# EAGLE design dual power supply1 (EAGLE 9.6.2)
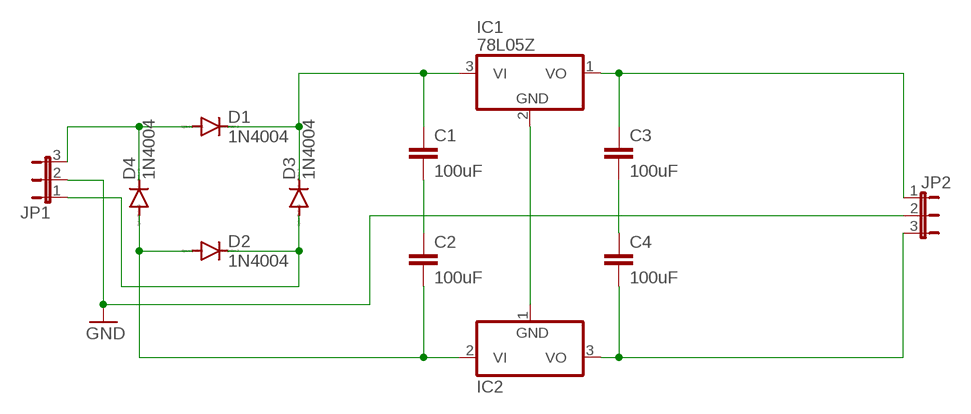
[diagram p0: schematic, sheet 1]

## Parts
C1  100uF  C2.5/2  [C2.5-2]
C2  100uF  C2.5/2  [C2.5-2]
C3  100uF  C2.5/2  [C2.5-2]
C4  100uF  C2.5/2  [C2.5-2]
D1  1N4004  [DO41-10]
D2  1N4004  [DO41-10]
D3  1N4004  [DO41-10]
D4  1N4004  [DO41-10]
IC1  78L05Z  [TO92]
IC2  7905L  [TO92]
JP1  JP2E  [JP2]
JP2  JP2E  [JP2]

## Nets
GND: JP1.2 JP2.2
N$1: D1.A D4.C JP1.3
N$2: C1.1 D1.C D3.C IC1.3(VI)
N$3: D2.C D3.A JP1.1
N$4: C2.2 D2.A D4.A IC2.2(VI)
N$6: IC1.2(GND) IC2.1(GND)
N$7: C3.1 IC1.1(VO) JP2.1
N$8: C4.2 IC2.3(VO) JP2.3
N$9: C1.2 C2.1
N$10: C3.2 C4.1

## Library data of the parts
C1-C4 = capacitor-wima:C: CAPACITOR naming: grid - package width
D1-D4 = diode:1N4004: DIODE general purpose rectifier, 1 A
IC1 = linear:78*: Positive VOLTAGE REGULATOR Source: http://cache.national.com/ds/LM/LM78L05.pdf http://www.fairchildsemi.com/ds/LM/LM7805.pdf
IC2 = linear:79*: Negative VOLTAGE REGULATOR
JP1 JP2 = jumper:JP2E: JUMPER

## Board
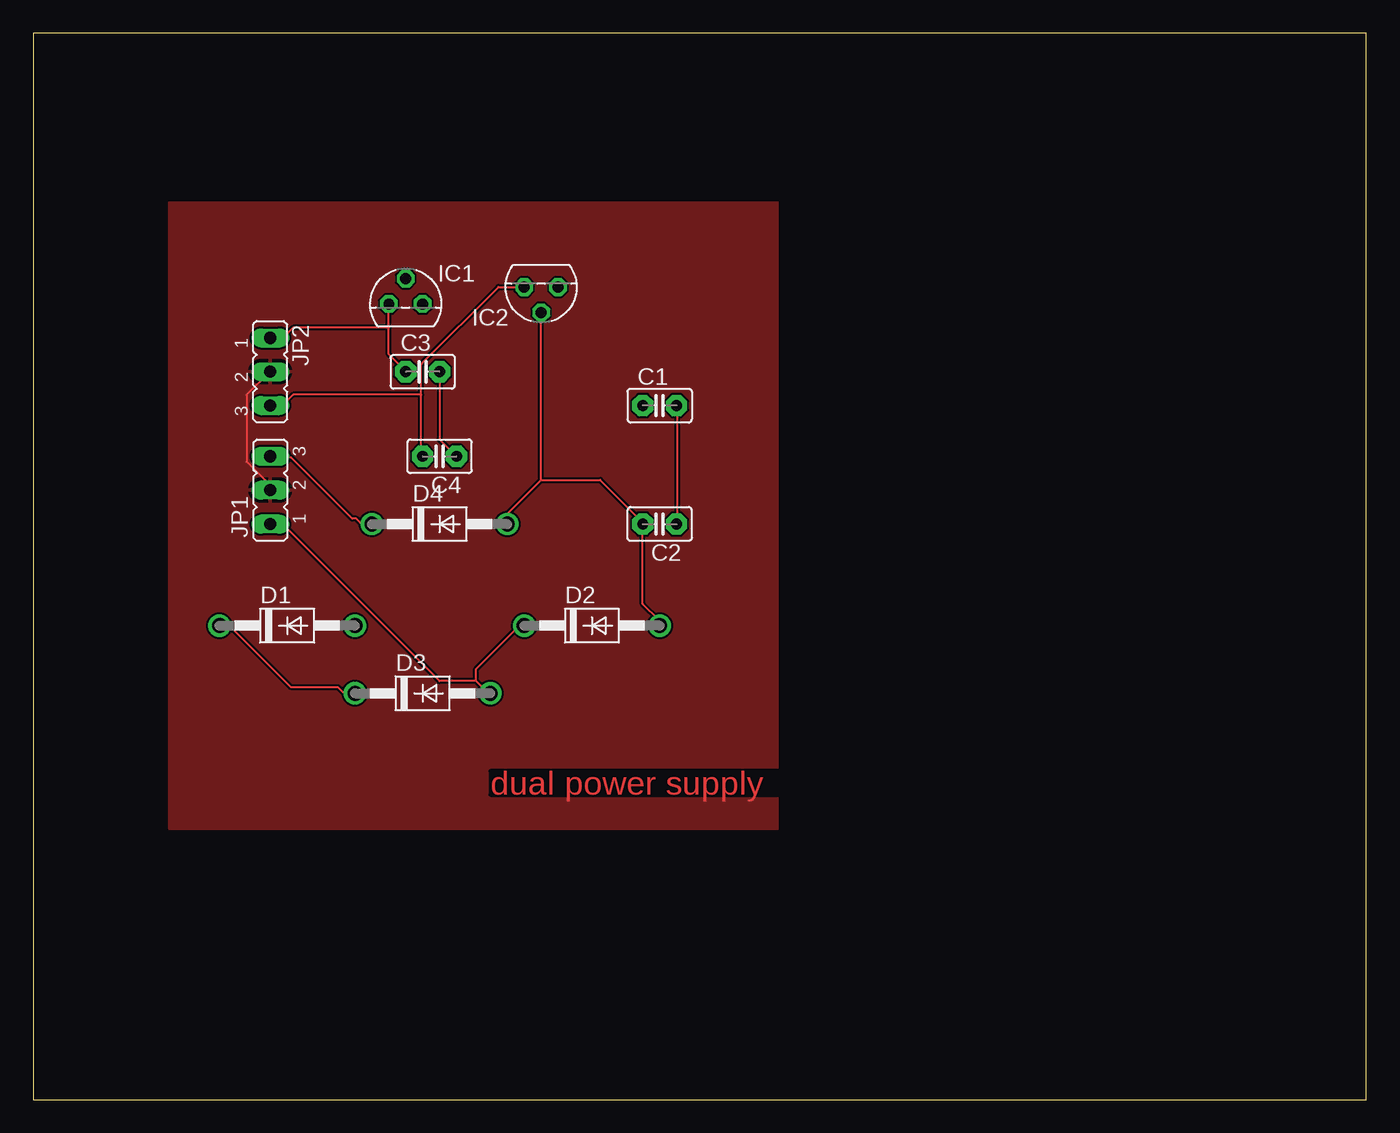
[diagram p1: board, top side]
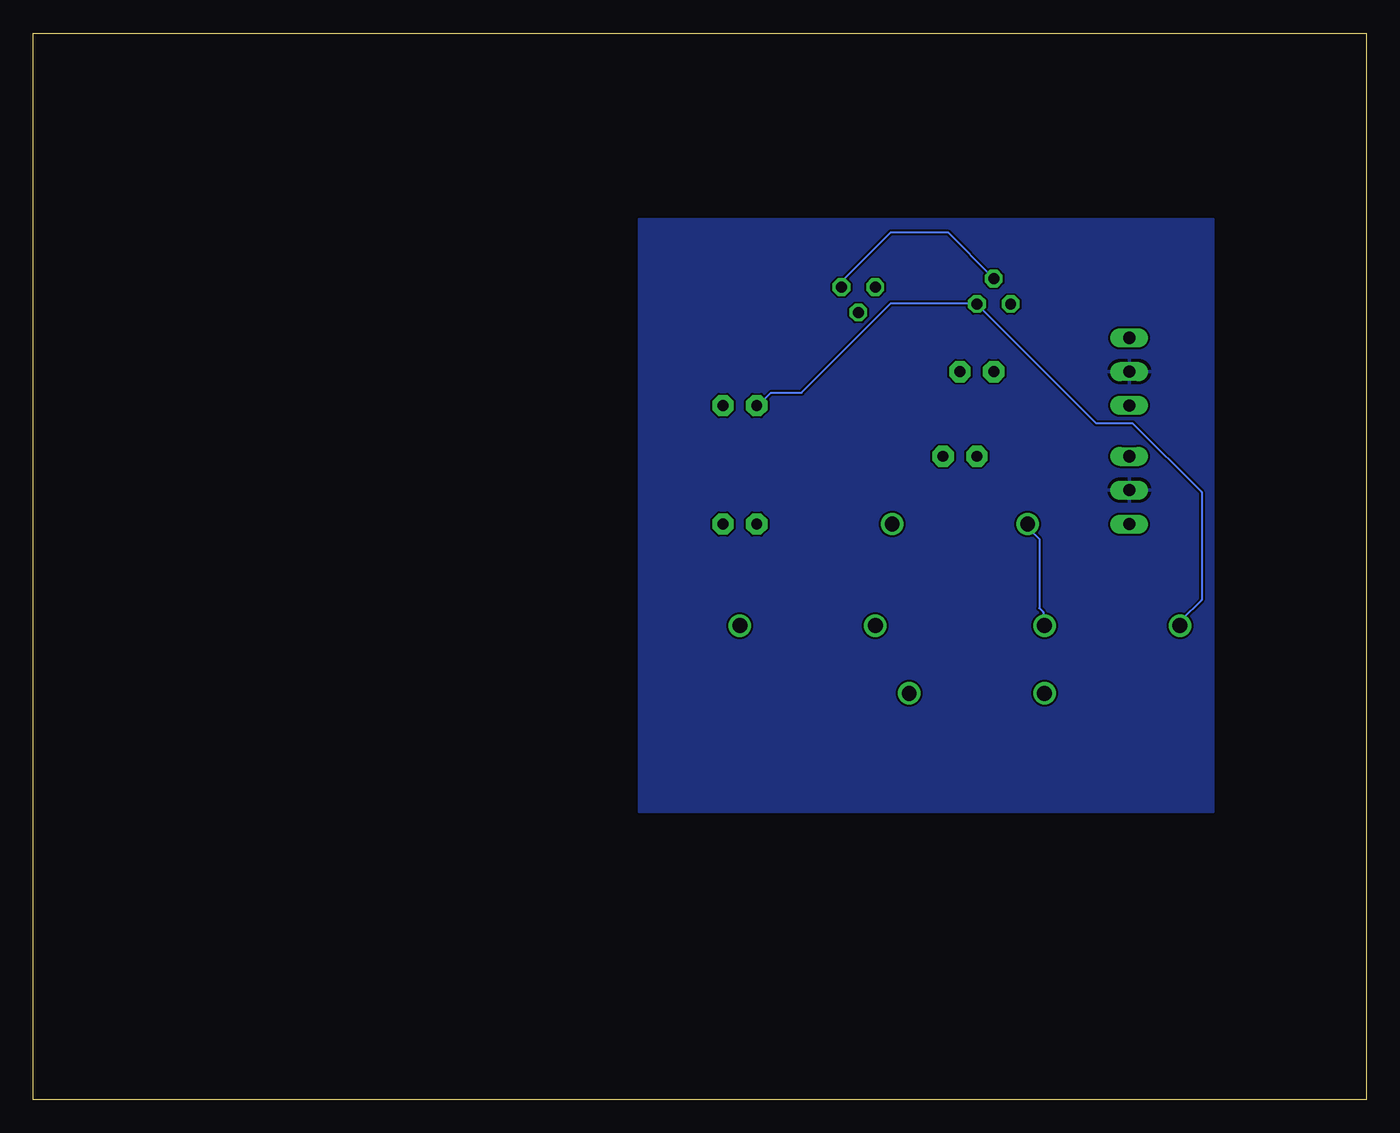
[diagram p2: board, bottom side, seen from below]

Size 100 x 80 mm. Coordinates in mm from the lower left corner, seen from the top.
Outline: 0,0 100,0 100,80 0,80 0,0
Copper layers (1*16): Top 0.035mm / dielectric 1.5mm / Bottom 0.035mm
Design rules "default": minimum track width 6mil, minimum drill 0.35mm, track to track 6mil, track to pad 6mil, pad to pad 6mil, via to via 6mil, smd to smd 6mil, copper to edge 40mil, drill to drill 6mil, minimum pad ring 10mil, minimum via ring 8mil, stop-mask expansion 4mil, vias tented up to drill 0mil, thermal gap 10mil

### Footprints (pad centres in the part's own frame; a part is rotated, then mirrored left to right if it is on the bottom)
C2.5-2 = drill 0.813 pad 1.6 octagon: 1 -1.27,0; 2 1.27,0
DO41-10 = drill 1.118: A 5.08,0; C -5.08,0
TO92 = drill 0.813 octagon: 1 -1.27,0; 2 0,1.905; 3 1.27,0
JP2 = drill 0.914 long: 1 -2.54,0; 2 0,0; 3 2.54,0

### Placement (x,y rotation side)
C1  46.99,52.07 0 top
C2  46.99,43.18 180 top
C3  29.21,54.61 0 top
C4  30.48,48.26 180 top
D1  19.05,35.56 0 top
D2  41.91,35.56 0 top
D3  29.21,30.48 0 top
D4  30.48,43.18 0 top
IC1  27.94,59.69 0 top
IC2  38.1,60.96 180 top
JP1  17.78,45.72 90 top
JP2  17.78,54.61 270 top

### Tracks (layer width: path | path; a pad name or v marks a point on that pad's centre or on a via)
GND
  Top 0.152: JP1.2 17.68,45.72 17.68,46.18 16,47.85 16,52.88 17.68,54.56 JP2.2
  pour Bottom: 11.43,66.04 54.61,66.04 54.61,21.59 11.43,21.59
  pour Top: 10.16,67.31 10.16,20.32 55.88,20.32 55.88,67.31
N$1
  Top 0.152: JP1.3 17.83,48.16 19.36,48.16 23.93,43.59 24.23,43.59 24.54,43.28 25.3,43.28 D4.C
  Bottom 0.152: D1.A 24.23,35.66 24.23,36.58 24.54,36.88 24.54,42.06 25.3,42.82 25.3,43.13 D4.C
N$2
  Top 0.152: D3.C 23.32,30.48 22.86,30.94 19.36,30.94 14.78,35.51 14.02,35.51 D1.C
  Bottom 0.152: C1.1 45.72,51.97 44.65,53.03 42.37,53.03 35.66,59.74 29.26,59.74 IC1.3 20.27,50.75 17.53,50.75 12.34,45.57 12.34,37.49 13.87,35.97 13.87,35.66 D1.C
N$3
  Top 0.152: 33.22,31.39 30.48,31.39 18.75,43.13 17.83,43.13 JP1.1 | 33.22,31.39 34.14,30.48 D3.A | 33.22,31.39 33.22,32.31 36.42,35.51 36.73,35.51 D2.C
N$4
  Top 0.152: D2.A 46.94,35.66 46.94,35.97 45.72,37.19 C2.2 45.72,43.28 42.52,46.48 38.1,46.48 | 38.1,46.48 IC2.2 | 38.1,46.48 35.66,44.04 35.66,43.28 D4.A
N$6
  Bottom 0.152: IC1.2 28.04,61.72 31.39,65.08 35.66,65.08 39.32,61.42 39.32,60.96 IC2.1
N$7
  Top 0.152: 26.67,57.91 26.67,55.93 27.89,54.71 C3.1 | 26.67,57.91 IC1.1 | JP2.1 18.75,57.15 19.51,57.91 26.67,57.91
N$8
  Top 0.152: IC2.3 34.9,60.96 29.11,55.17 29.11,52.88 | 29.11,52.88 29.11,48.31 C4.2 | 29.11,52.88 19.51,52.88 18.75,52.12 17.83,52.12 JP2.3
N$9
  Top 0.152: C2.1 48.31,43.28 48.31,51.97 C1.2
N$10
  Top 0.152: C4.1 30.48,49.53 C3.2

### Text on the board
Top: dual power supply